# Altium project ESC_V2_Design.PrjPcb
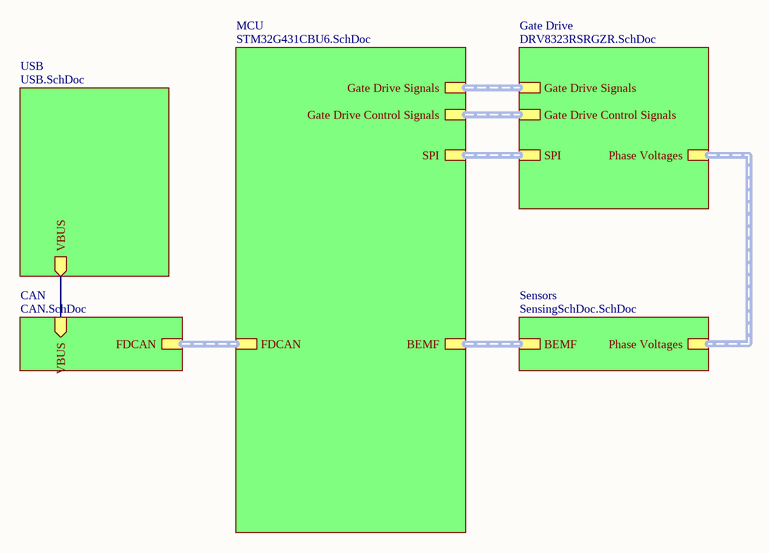
[diagram p0: Top Level.SchDoc]
6 sheets, 96 parts. Net scope: hierarchical (ports join the sheet entries above them; power ports are global).
Board file: PCB1.PcbDoc
Sheets:
  Top Level.SchDoc
    MCU = STM32G431CBU6.SchDoc
    Gate Drive = DRV8323RSRGZR.SchDoc
    Sensors = SensingSchDoc.SchDoc
    CAN = CAN.SchDoc
    USB = USB.SchDoc

## Sheet Top Level.SchDoc
size A4; SheetNumber: 1; SheetTotal: 6

### Sub-sheets
CAN = CAN.SchDoc: FDCAN, VBUS (in)
Gate Drive = DRV8323RSRGZR.SchDoc: Gate Drive Signals, SPI, Gate Drive Control Signals, Phase Voltages
MCU = STM32G431CBU6.SchDoc: Gate Drive Signals, SPI, Gate Drive Control Signals, BEMF, FDCAN
Sensors = SensingSchDoc.SchDoc: BEMF, Phase Voltages
USB = USB.SchDoc: VBUS (out)

### Nets
VBUS: sheet CAN/VBUS, sheet USB/VBUS

### Buses and harness runs
harness sheet CAN/FDCAN = sheet MCU/FDCAN
harness sheet Gate Drive/Gate Drive Control Signals = sheet MCU/Gate Drive Control Signals
harness sheet Gate Drive/Gate Drive Signals = sheet MCU/Gate Drive Signals
harness sheet Gate Drive/Phase Voltages = sheet Sensors/Phase Voltages
harness sheet Gate Drive/SPI = sheet MCU/SPI
harness sheet MCU/BEMF = sheet Sensors/BEMF

## Sheet STM32G431CBU6.SchDoc
size A3; SheetNumber: 2; SheetTotal: 6
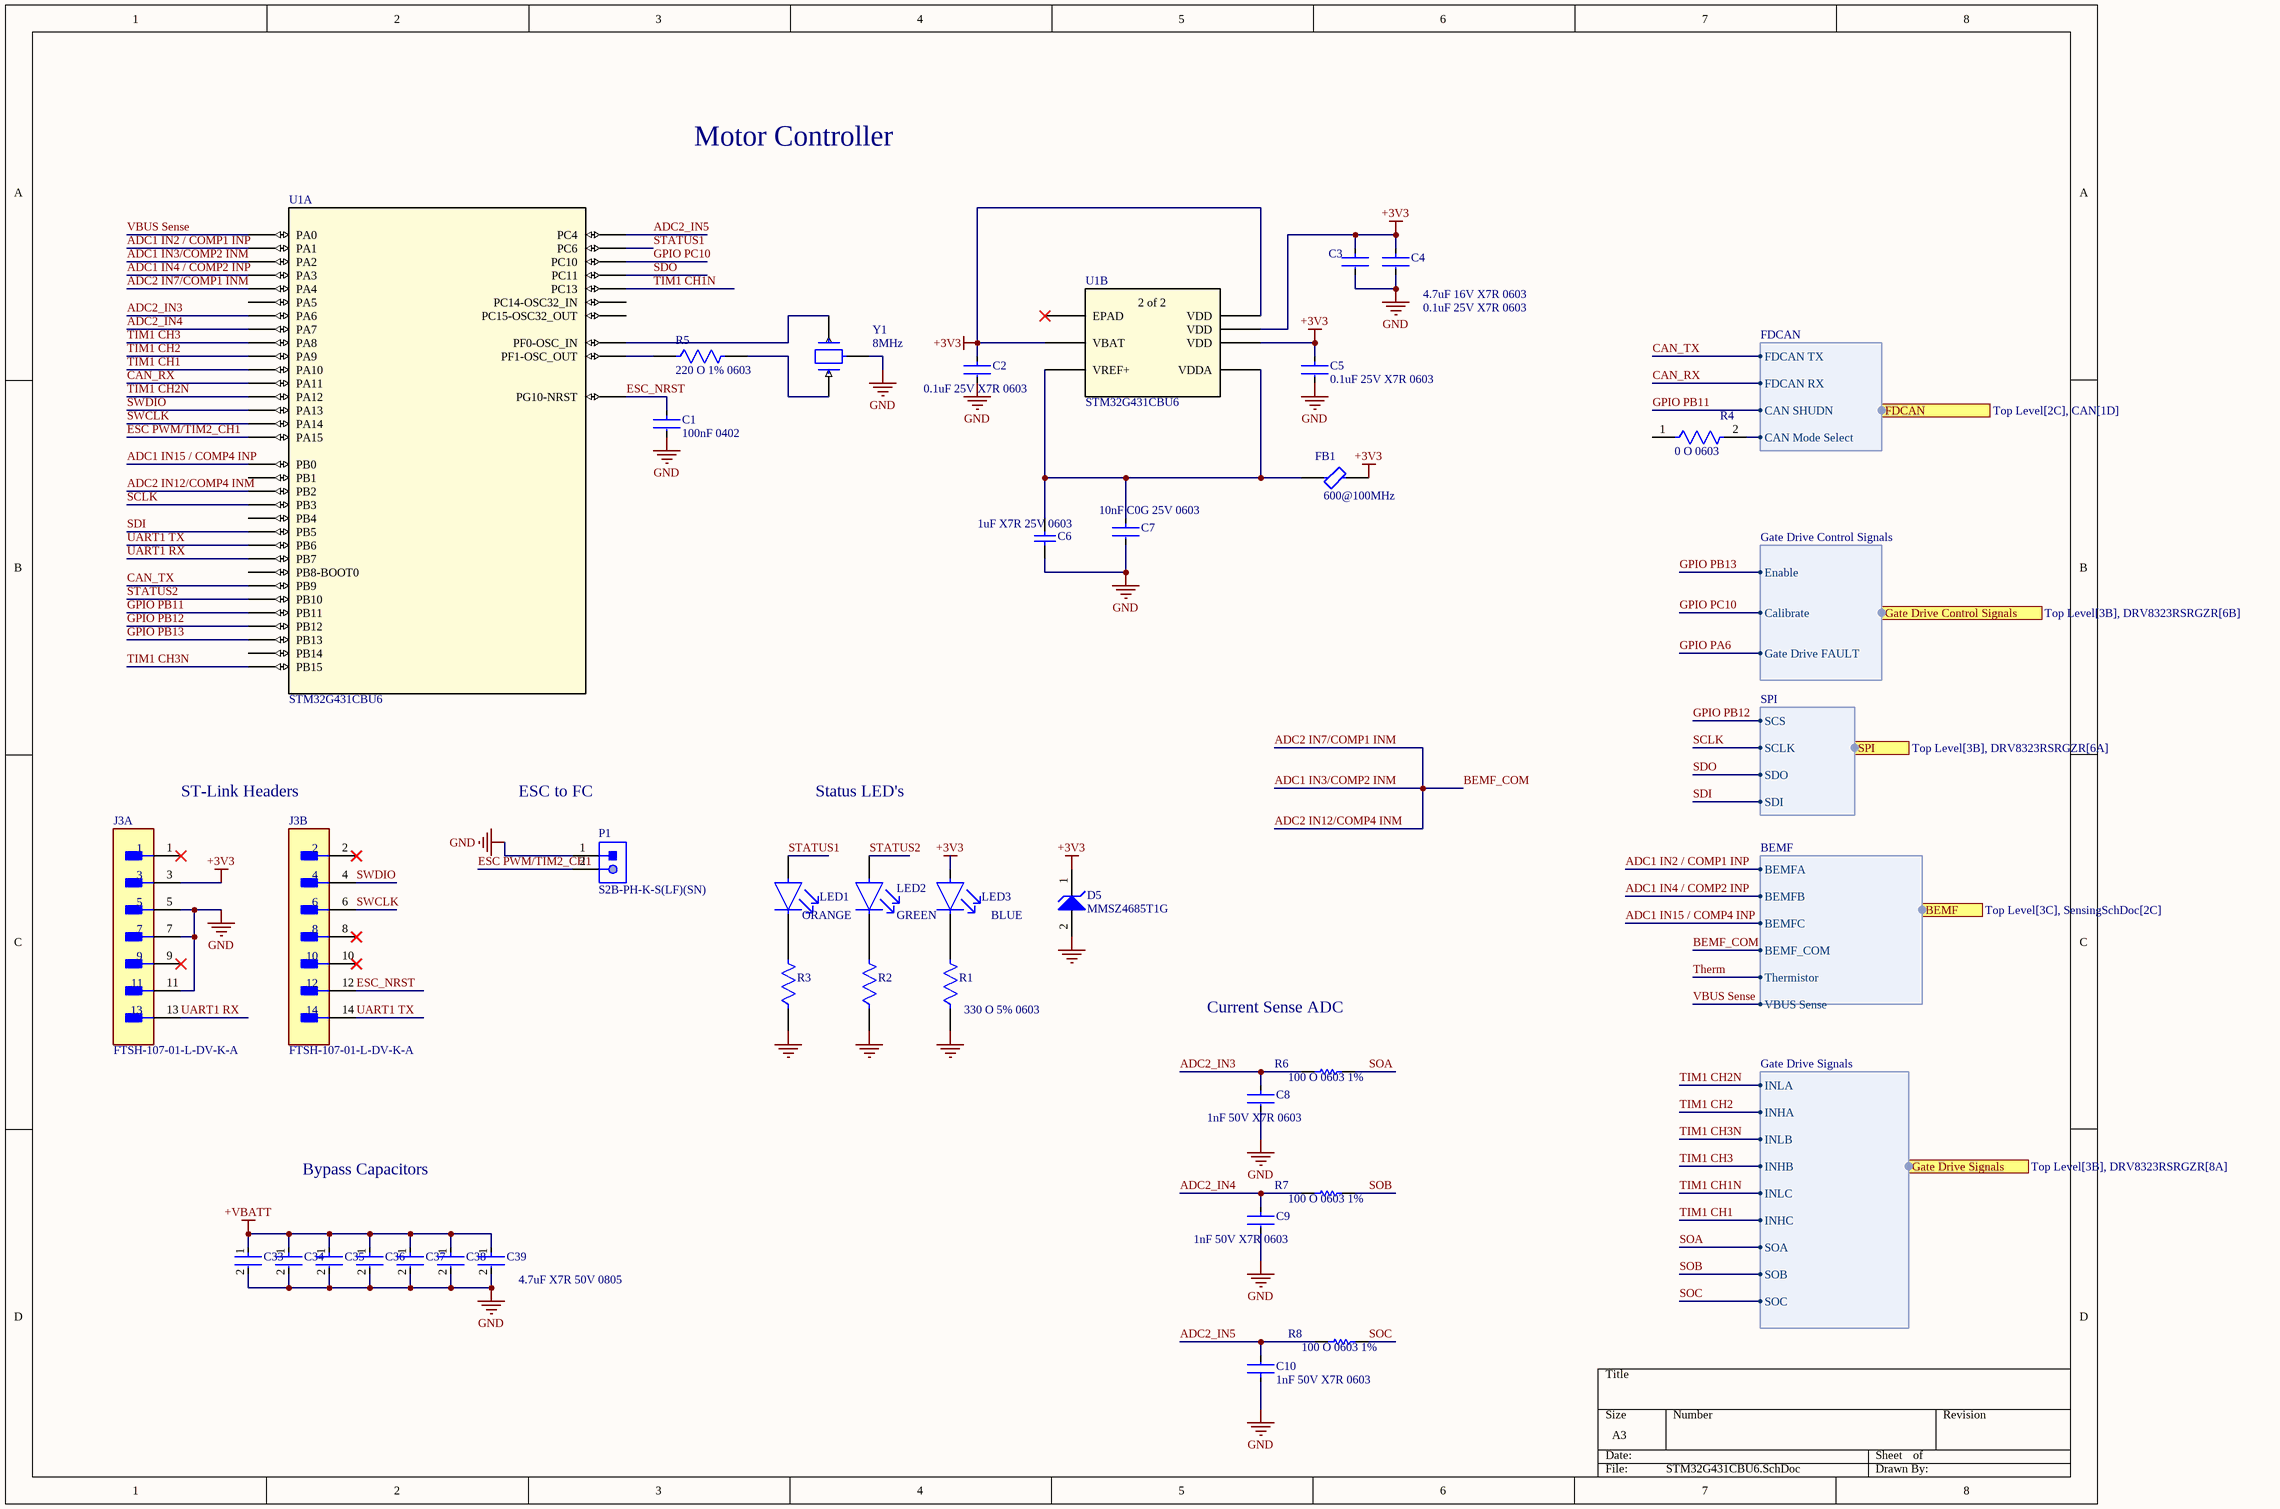
[diagram p1: STM32G431CBU6.SchDoc]

### Parts
C1  100nF 0402  [FP-GRM155-0_05-MFG]
C2  0.1uF 25V X7R 0603  [FP-C0603C-CF-MFG]
C3  4.7uF 16V X7R 0603  [FP-GRM188-0_2-IPC_A]
C4  0.1uF 25V X7R 0603  [FP-C0603C-CF-MFG]
C5  0.1uF 25V X7R 0603  [FP-C0603C-CF-MFG]
C6  1uF X7R 25V 0603  [CAPC1608X95X35NL15T15]
C7  10nF C0G 25V 0603  [FP-C0603C-CF-MFG]
C8  1nF 50V X7R 0603  [FP-C0603C-CF-MFG]
C9  1nF 50V X7R 0603  [FP-C0603C-CF-MFG]
C10  1nF 50V X7R 0603  [FP-C0603C-CF-MFG]
C33  4.7uF X7R 50V 0805  [FP-GRM21B-0_2-e0_2_0_7-IPC_C]  (value not drawn)
C34  4.7uF X7R 50V 0805  [FP-GRM21B-0_2-e0_2_0_7-IPC_C]  (value not drawn)
C35  4.7uF X7R 50V 0805  [FP-GRM21B-0_2-e0_2_0_7-IPC_C]  (value not drawn)
C36  4.7uF X7R 50V 0805  [FP-GRM21B-0_2-e0_2_0_7-IPC_C]  (value not drawn)
C37  4.7uF X7R 50V 0805  [FP-GRM21B-0_2-e0_2_0_7-IPC_C]  (value not drawn)
C38  4.7uF X7R 50V 0805  [FP-GRM21B-0_2-e0_2_0_7-IPC_C]  (value not drawn)
C39  4.7uF X7R 50V 0805  [FP-GRM21B-0_2-e0_2_0_7-IPC_C]
D5  MMSZ4685T1G  [ONSC-SOD-123-2-425-04_V]
FB1  600@100MHz  [FP-MPZ1608-0_8-MFG]
J3  FTSH-107-01-L-DV-K-A  [FP-FTSH-107-01-L-DV-K-A-MFG]  (parts A,B of 2)
LED1  ORANGE  [FP-6_541-5092_01-4-MFG]
LED2  GREEN  [FP-LTST-C193KGKT-5A-MFG]
LED3  BLUE  [FP-APT1608QBC-D-MFG]
P1  S2B-PH-K-S(LF)(SN)  [JST-S2B-PH-K-S_V]
R1  330 O 5% 0603  [FP-AC0603-IPC_C]
R2  AC0603JR-07330RL  [FP-AC0603-IPC_C]  (value not drawn)
R3  AC0603JR-07330RL  [FP-AC0603-IPC_C]  (value not drawn)
R4  0 O 0603  [FP-MCT0603-IPC_C]
R5  220 O 1% 0603  [FP-AC0603-IPC_A]
R6  100 O 0603 1%  [RESC1608X55X25ML10T15]
R7  100 O 0603 1%  [RESC1608X55X25ML10T15]
R8  100 O 0603 1%  [RESC1608X55X25ML10T15]
U1  STM32G431CBU6  [UFQFPN-48_7X7X0P55MM]  (parts A,B of 2)
Y1  8MHz  [FP-CSTNE8M00GH5C000R0-MFG]

### Ports
BEMF (harness BEMF, see Top Level[3C], SensingSchDoc[2C]), FDCAN (harness FDCAN, see Top Level[2C], CAN[1D]), Gate Drive Control Signals (harness Gate Drive Control Signals, see Top Level[3B], DRV8323RSRGZR[6B]), Gate Drive Signals (harness Gate Drive Signals, see Top Level[3B], DRV8323RSRGZR[8A]), SPI (harness SPI, see Top Level[3B], DRV8323RSRGZR[6A])

### Harnesses
SPI: SCLK, SDO, SDI, SCS
Gate Drive Signals: INLA, INHA, INLB, INHB, INLC, INHC, SOA, SOB, SOC
Gate Drive Control Signals: Enable, Calibrate, Gate Drive FAULT
BEMF: BEMFA, BEMFB, BEMFC, VBUS Sense, Thermistor, BEMF_COM
FDCAN: FDCAN TX, FDCAN RX, CAN SHUDN, CAN Mode Select

### Nets
+3V3: C2.1 C3.1 C4.1 C5.1 D5.1(K) FB1.2 J3.3 LED3.2(A) U1.1(VBAT) U1.23(VDD) U1.35(VDD) U1.48(VDD)
+VBATT: C33.1 C34.1 C35.1 C36.1 C37.1 C38.1 C39.1
GND: C1.2 C2.2 C3.2 C4.2 C5.2 C6.1 C7.2 C8.2 C9.2 C10.1 C33.2 C34.2 C35.2 C36.2 C37.2 C38.2 C39.2 D5.2(A) J3.5 J3.7 J3.11 P1.1 R1.1 R2.1 R3.1 Y1.2(GND)  [project net SNA]
ADC1 IN2 / COMP1 INP: U1.9(PA1) ; port BEMF.BEMFA
ADC1 IN3/COMP2 INM: U1.10(PA2) U1.12(PA4) U1.19(PB2) ; port BEMF.BEMF_COM  [also labelled ADC2 IN12/COMP4 INM, ADC2 IN7/COMP1 INM, BEMF_COM]
ADC1 IN4 / COMP2 INP: U1.11(PA3) ; port BEMF.BEMFB
ADC1 IN15 / COMP4 INP: U1.17(PB0) ; port BEMF.BEMFC
ADC2_IN3: C8.1 R6.1 U1.14(PA6)
ADC2_IN4: C9.1 R7.1 U1.15(PA7)
ADC2_IN5: C10.2 R8.1 U1.16(PC4)
CAN Mode: R4.2 ; port FDCAN.CAN Mode Select
CAN_RX: U1.33(PA11) ; port FDCAN.FDCAN RX
CAN_TX: U1.47(PB9) ; port FDCAN.FDCAN TX
ESC PWM/TIM2_CH1: P1.2 U1.38(PA15)
ESC_NRST: C1.1 J3.12 U1.7(PG10-NRST)
GPIO PB11: U1.24(PB11) ; port FDCAN.CAN SHUDN
GPIO PB12: U1.25(PB12) ; port SPI.SCS
GPIO PB13: U1.26(PB13) ; port Gate Drive Control Signals.Enable
GPIO PC10: U1.39(PC10) ; port Gate Drive Control Signals.Calibrate
SCLK: U1.41(PB3) ; port SPI.SCLK
SDI: U1.43(PB5) ; port SPI.SDI
SDO: U1.40(PC11) ; port SPI.SDO
SOA: R6.2 ; port Gate Drive Signals.SOA
SOB: R7.2 ; port Gate Drive Signals.SOB
SOC: R8.2 ; port Gate Drive Signals.SOC
STATUS1: LED1.2(A) U1.29(PC6)
STATUS2: LED2.2(A) U1.22(PB10)
SWCLK: J3.6 U1.37(PA14)
SWDIO: J3.4 U1.36(PA13)
TIM1 CH1: U1.32(PA10) ; port Gate Drive Signals.INHC
TIM1 CH1N: U1.2(PC13) ; port Gate Drive Signals.INLC
TIM1 CH2: U1.31(PA9) ; port Gate Drive Signals.INHA
TIM1 CH2N: U1.34(PA12) ; port Gate Drive Signals.INLA
TIM1 CH3: U1.30(PA8) ; port Gate Drive Signals.INHB
TIM1 CH3N: U1.28(PB15) ; port Gate Drive Signals.INLB
UART1 RX: J3.13 U1.45(PB7)
UART1 TX: J3.14 U1.44(PB6)
VBUS Sense: U1.8(PA0) ; port BEMF.VBUS Sense
NetC6_2: C6.2 C7.1 FB1.1 U1.20(VREF+) U1.21(VDDA)
NetLED1_1: LED1.1(C) R3.2
NetLED2_1: LED2.1(C) R2.2
NetLED3_1: LED3.1(C) R1.2
NetR5_1: R5.1 U1.6(PF1-OSC_OUT)
NetR5_2: R5.2 Y1.1(Input)
NetU1_5: U1.5(PF0-OSC_IN) Y1.3(Output)

Not connected (* = marked no-connect by the designer): J3 1* 2* 8* 9* 10*; R4 1; U1 3(PC14-OSC32_IN) 4(PC15-OSC32_OUT) 13(PA5) 18(PB1) 27(PB14) 42(PB4) 46(PB8-BOOT0) 49(EPAD)*

### Notes on the sheet
- Motor Controller
- ST-Link Headers
- ESC to FC
- Status LED's
- Current Sense ADC
- Bypass Capacitors
- (in symbol STM32G431CBU6, part B) 2 of 2

### Library data of the parts
C1 = CMP-06035-025734-1: Chip Multilayer Ceramic Capacitors for General Purpose, 0402, 0.10uF, X7R, 15%, 20%, 25V
C2 C4 C5 = CMP-2006-03731-2: CAP CER 0.1UF 25V X7R 0603; Manufacturer Part Number: C0603C104K3RACAUTO; Manufacturer: KEMET; Capacitance: 0.10 μF; Automotive Grade: Grade 1; Tolerance: 0.1; Material: Ceramic; Temperature Coefficient: 30ppm/°C; Value: 0.10 μF; Digikey Description: CAP CER 0.1UF 25V X7R 0603; RoHS: TRUE; ComponentLink2Description: Datasheet; Temperature Range High: +125°C; Temperature Characteristic: X7R; Automotive: Yes; Package: C0603C-CF; ComponentLink2URL: https://api.kemet.com/component-edge/download/datasheet/C0603C100J5GACAUTO.pdf; Lead Free: Yes; Device Class L2: Capacitors; Device Class L3: Ceramic Capacitors; Device Class L1: Passive Components; Octopart: https://octopart.com/c0603c104k3racauto-kemet-12595587; Height: 0.87mm; Mouser Description: Multilayer Ceramic Capacitors MLCC - SMD/SMT 0.1uF 25volts 10% X7R AUTO; Category: Cap; Voltage Rating: 25 V; Temperature Range Low: -55°C; Temperature: -55°C to +125°C
C3 = CMP-06035-045467-1: Chip Multilayer Ceramic Capacitors for General Purpose, 0603, 4.7uF, X7R, 15%, 10%, 16V
C6 = CMP-2006-02217-1: Part Number: C0603C105M3RACTU; Manufacturer: Kemet
C7 = CMP-03020-015349-1: C0603 10,000 pF C0G 30ppm/°C 5.00% 25 V; Manufacturer: KEMET; Manufacturer Part Number: C0603C103J3GACAUTO; Automotive Grade: Grade 1; Material: Ceramic; Tolerance: 0.05; Mouser Description: Cap Ceramic 0.01uF 25V C0G 5% Pad SMD 0603 125C Automotive T/R; Temperature Characteristic: C0G; Device Class L3: Ceramic Capacitors; Device Class L1: Passive Components; Capacitance: 10,000 pF; Temperature Range High: +125°C; Voltage Rating: 25 V; RoHS: TRUE; Temperature: -55°C to +125°C; Device Class L2: Capacitors; Temperature Range Low: -55°C; Package: C0603C-CF; Value: 10,000 pF; ComponentLink2Description: Datasheet; Height: 0.87mm; Octopart: https://octopart.com/c0603c103j3gacauto-kemet-75532652; Lead Free: Yes; Automotive: Yes; ComponentLink2URL: https://api.kemet.com/component-edge/download/datasheet/C0603C100J5GACAUTO.pdf; Category: Cap; Temperature Coefficient: 30ppm/°C
C8-C10 = CMP-2006-03716-2: CAP CER 1000PF 50V X7R 0603; Manufacturer Part Number: C0603C102K5RACAUTO; Manufacturer: KEMET; Material: Ceramic; Automotive Grade: Grade 1; Value: 1,000 pF; Tolerance: 0.1; Temperature Coefficient: 30ppm/°C; Category: Cap; Automotive: Yes; Temperature Range High: +125°C; Temperature Range Low: -55°C; Temperature Characteristic: X7R; Device Class L1: Passive Components; Height: 0.87mm; Lead Free: Yes; Capacitance: 1,000 pF; Package: C0603C-CF; Digikey Description: CAP CER 1000PF 50V X7R 0603; Voltage Rating: 50 V; ComponentLink2URL: https://api.kemet.com/component-edge/download/datasheet/C0603C100J5GACAUTO.pdf; Mouser Description: Multilayer Ceramic Capacitors MLCC - SMD/SMT 1000pF 50volts 10% X7R AUTO; RoHS: TRUE; Octopart: https://octopart.com/c0603c102k5racauto-kemet-18822673; Device Class L3: Ceramic Capacitors; ComponentLink2Description: Datasheet; Device Class L2: Capacitors; Temperature: -55°C to +125°C
C33-C39 = CMP-06035-056600-1: Chip Multilayer Ceramic Capacitors for General Purpose, 0805, 4.7uF, X7R, 15%, 10%, 50V
D5 = CMP-1060-00574-1: Zener Voltage Regulator, 500 mW, 2-Pin SOD-123, Pb-Free, Tape and Reel; Manufacturer: On Semiconductor; VZ Typ (V): 3.6; P Max (W): 0.5; DatasheetVersion: Rev. 9; ComponentLink2Description: Datasheet; Mounting Technology: Surface Mount; ComponentLink3URL: http://www.onsemi.com/pub_link/Collateral/425-04.PDF; ComponentLink3Description: Package Specification; RoHS: Pb-Free; PartNumber: MMSZ4685T1G; ComponentLink1URL: http://www.onsemi.com/; PackageDescription: 2-Pin SOD, Body 1.6 x 2.69 mm; ComponentLink2URL: http://www.onsemi.com/pub_link/Collateral/MMSZ4678T1-D.PDF; ComponentLink1Description: Manufacturer URL; Packing: Tape and Reel; PackageVersion: Rev. G, 10/2009; PackageReference: SOD-123-2-425-04
FB1 = CMP-08257-000179-1: Power line Ferrite Bead 600Ω @ 100MHz 1A DCR 0.15Ω SMD 0603; Impedance: 600R; DC Resistance (DCR): 150mR; Tolerance: 25%; Depth: 0.8mm; Packaging: Tape and Reel; Package Quantity: 4000; Height: 0.8mm; Length: 0.063inch; Series: MPZ; Weight: 7.1E-05oz; Width: 0.8mm; Mount: Surface Mount; Case Code (Imperial): 0603; Case/Package: 0603; Max Operating Temperature: 125°C; Max DC Current: 1A; Test Frequency: 100MHz; Min Operating Temperature: -55°C; Current Rating: 1A; Core Material: Ferrite; RoHS Compliant: Yes; REACH SVHC: No SVHC; Case Code (Metric): 1608; Termination: SMD/SMT; Lead Free: Lead Free
J3 = CMP-02766-001414-1: CONN HEADER SMD 14POS 1.27MM; Number of Contacts: 14; Gender: Male; Contact Plating: Gold; Termination: Solder; Lead Free: Lead Free; Contact Material: Bronze; Pitch: 1.27mm; Number of Rows: 2; RoHS Compliant: Yes
LED1 = CMP-00030-21709200-1: VLMO1300-GS08 LED Uni-Color Soft Orange 611nm 2-Pin Chip 0603(1608Metric) T/R; Test Current: 20mA; Dominant Wavelength: 605nm; Lens Style: Clear, Rectangular; Reverse Voltage: 5V; Power Dissipation: 75mW; Luminous Intensity: 90mcd; Viewing Angle: 130°; Number of LEDs: 1; Forward Voltage: 2V; Illumination Color: Orange; Ambient Temperature Range High: 85°C; Radiation Hardening: No; Case Code (Metric): 1608; Case Code (Imperial): 0603; Forward Current: 20mA; Number of Pins: 2; Packaging: Cut Tape; Case/Package: 0603; Depth: 800µm; RoHS: Compliant; Schedule B: 8541402000, 8541402000; Length: 1.6mm; Power Rating: 75mW; Mount: Surface Mount; NexarPartId: 21709200; Min Operating Temperature: -35°C; Width: 800µm; REACH SVHC: Unknown; Lead Free: Lead Free; Color: Orange; Wavelength: 605nm; Max Operating Temperature: 85°C; Height: 800µm; Number of Elements: 1
LED2 = CMP-2000-06622-2: LED GREEN CLEAR CHIP SMD; Forward Current: 30mA; Power Dissipation: 75mW; Luminous Intensity: 28mcd; Lens Style: Diffused; Lens Color: Colorless; Forward Voltage: 2.3V; Test Current: 5mA; Viewing Angle: 130°; Reverse Voltage: 5V; Dominant Wavelength: 576.5nm; Number of Elements: 1; Number of Pins: 2; Case/Package: 0603; Width: 0.8mm; Radiation Hardening: No; Lead Free: Lead Free; Lens Transparency: Clear; Max Operating Temperature: 85°C; Illumination Color: Green; Color: Green; Packaging: Tape and Reel; Depth: 0.8mm; Length: 1.6mm; Mount: Surface Mount; Case Code (Imperial): 0603; Height: 0.35mm; Min Operating Temperature: -55°C; Package Quantity: 3000; Case Code (Metric): 1608; Power Rating: 75mW; Number of LEDs: 1
LED3 = CMP-2000-05788-2: LED BLUE CLEAR CHIP SMD; Lens Style: Flat; Forward Current: 20mA; Luminous Intensity: 100mcd; Number of LEDs: 1; Dominant Wavelength: 465nm; Lens Color: Colorless; Forward Voltage: 3.3V; Viewing Angle: 120°; Case Code (Imperial): 0603; Number of Pins: 2; Length: 1.6mm; Mount: Surface Mount; Color: Blue; Width: 0.8mm; Height: 0.75mm; Case/Package: 0603; Lead Free: Lead Free; Case Code (Metric): 1608; Lens Transparency: Clear; Min Operating Temperature: -40°C; Packaging: Tape and Reel; Max Operating Temperature: 85°C; Package Quantity: 2000; Test Current: 20mA; Illumination Color: Blue
P1 = CMP-1755-00004-1: Male Header, Pitch 2 mm, 1 x 2 Position, Height 4.8 mm, Tail Length 3.4 mm, -25 to 85 degC, RoHS, Bulk; Case\Package: Radial; Tolerance: 20%; Capacitance: 10 uF; Voltage Rating (DC): 50 V; Packaging: Bulk; ComponentLink1URL: http://www.jst-mfg.com/product/pdf/eng/ePH.pdf; Radiation Hardening: No; Height: 11 mm; Package Quantity: 200; PackageDescription: Male Header, Pitch 2 mm, 1 x 2 Position, Height 4.8 mm, Tail Length 3.4 mm; PackageReference: S2B-PH-K-S; Diameter: 5 mm; Pins: 2; Mount: Through Hole; Max Operating Temperature: 85 degC; Min Operating Temperature: -40 degC; ComponentLink1Description: Datasheet; DatasheetVersion: Dec-12; Length: 11 mm; Lead Pitch: 2 mm; REACH SVHC: No SVHC; Voltage Rating: 50 V; RoHSCompliant: true
R1 = CMP-03412-039929-1: RES 330Ω 5.00% 0.1W 0603; Voltage Rating: 50V; Power Rating: 100mW; Temperature Coefficient: 100ppm/°C; Resistance: 330R; Series: AC; Case/Package: 0603; Weight: 7.1E-05oz; Min Operating Temperature: -55°C; Ratings: AEC-Q200; Width: 0.8mm; Resistor Type: Thick Film; Termination: SMD/SMT; Tolerance: 5%; Number of Terminations: 2; Max Power Dissipation: 100mW; Case Code (Imperial): 0603; Case Code (Metric): 1608; Height: 0.45mm; Max Operating Temperature: 155°C; Length: 1.6mm; RoHS Compliant: Yes; Features: Moisture Resistant; Packaging: Tape and Reel
R2 R3 = CMP-03412-039929-1: RES 330Ω 5.00% 0.1W 0603; Voltage Rating: 50V; Power Rating: 100mW; Tolerance: 5%; Temperature Coefficient: 100ppm/°C; Resistance: 330R; Series: AC; Case/Package: 0603; Weight: 7.1E-05oz; Min Operating Temperature: -55°C; Ratings: AEC-Q200; Width: 0.8mm; Resistor Type: Thick Film; Termination: SMD/SMT; Number of Terminations: 2; Max Power Dissipation: 100mW; Case Code (Imperial): 0603; Case Code (Metric): 1608; Height: 0.45mm; Max Operating Temperature: 155°C; Length: 1.6mm; RoHS Compliant: Yes; Features: Moisture Resistant; Packaging: Tape and Reel
R4 = CMP-02407-001385-1: RES SMD 100 OHM 1% 1/8W 0603; Voltage Rating (DC): 75V; Resistance: 0mR; Max Power Dissipation: 125mW; Power Rating: 100mW; Case Code (Imperial): 0603; Packaging: Tape and Reel; Length: 1.55mm; Case Code (Metric): 1608; Military Standard: Not; Lead Free: Lead Free; Width: 0.033inch; Voltage Rating: 75V; Case/Package: 0603; Composition: Thin Film; Radiation Hardening: No; Depth: 0.85mm; Max Operating Temperature: 125°C; Number of Terminations: 2; Height: 0.022inch; REACH SVHC: No SVHC; Mount: Surface Mount; Package Quantity: 1; Contact Plating: Tin; Min Operating Temperature: -55°C
R5 = CMP-03412-024663-2: RES 220Ω 1.00% 0.1W 0603; Max Power Dissipation: 100mW; Voltage Rating: 50V; Temperature Coefficient: 100ppm/°C; Resistance: 220R; Max Operating Temperature: 155°C; Case/Package: 0603; Case Code (Imperial): 0603; RoHS Compliant: Yes; Height: 0.45mm; Case Code (Metric): 1608; Resistor Type: Thick Film; Width: 0.8mm; Series: AC; Number of Terminations: 2; Features: Moisture Resistant; Tolerance: 1%; Ratings: AEC-Q200; Min Operating Temperature: -55°C; Power Rating: 100mW; Packaging: Tape and Reel; Termination: SMD/SMT; Length: 1.6mm
R6-R8 = CMP-2000-04173-1: Part Number: RC0603FR-10100RL; Manufacturer: Yageo
U1 = STM32G431CBU6: Mainstream Arm Cortex-M4 MCU 170 MHz with 128 Kbytes of Flash memory, Math Accelerator, Medium Analog level integration; Manufacturer_Name: STMicroelectronics; Copyright: Copyright (C) 2025 Ultra Librarian. All rights reserved.; Manufacturer_Part_Number: STM32G431CBU6; Datasheet: https://www.st.com/resource/en/datasheet/stm32g431c6.pdf; RefDes: RefDes; Type: Type
Y1 = CMP-06057-000001-1: CERAMIC RES 8.0000MHZ 33PF SMD; Frequency Stability: 0.13%; Frequency Tolerance: 0.07%; Impedance: 40R; Mount: Surface Mount; Min Operating Temperature: -40°C; Max Operating Temperature: 125°C; Resistor Type: Ceramic; Capacitance: 33pF; Packaging: Tape and Reel; Frequency: 8MHz; Case/Package: SMD/SMT

## Sheet DRV8323RSRGZR.SchDoc
size A3; SheetNumber: 3; SheetTotal: 6
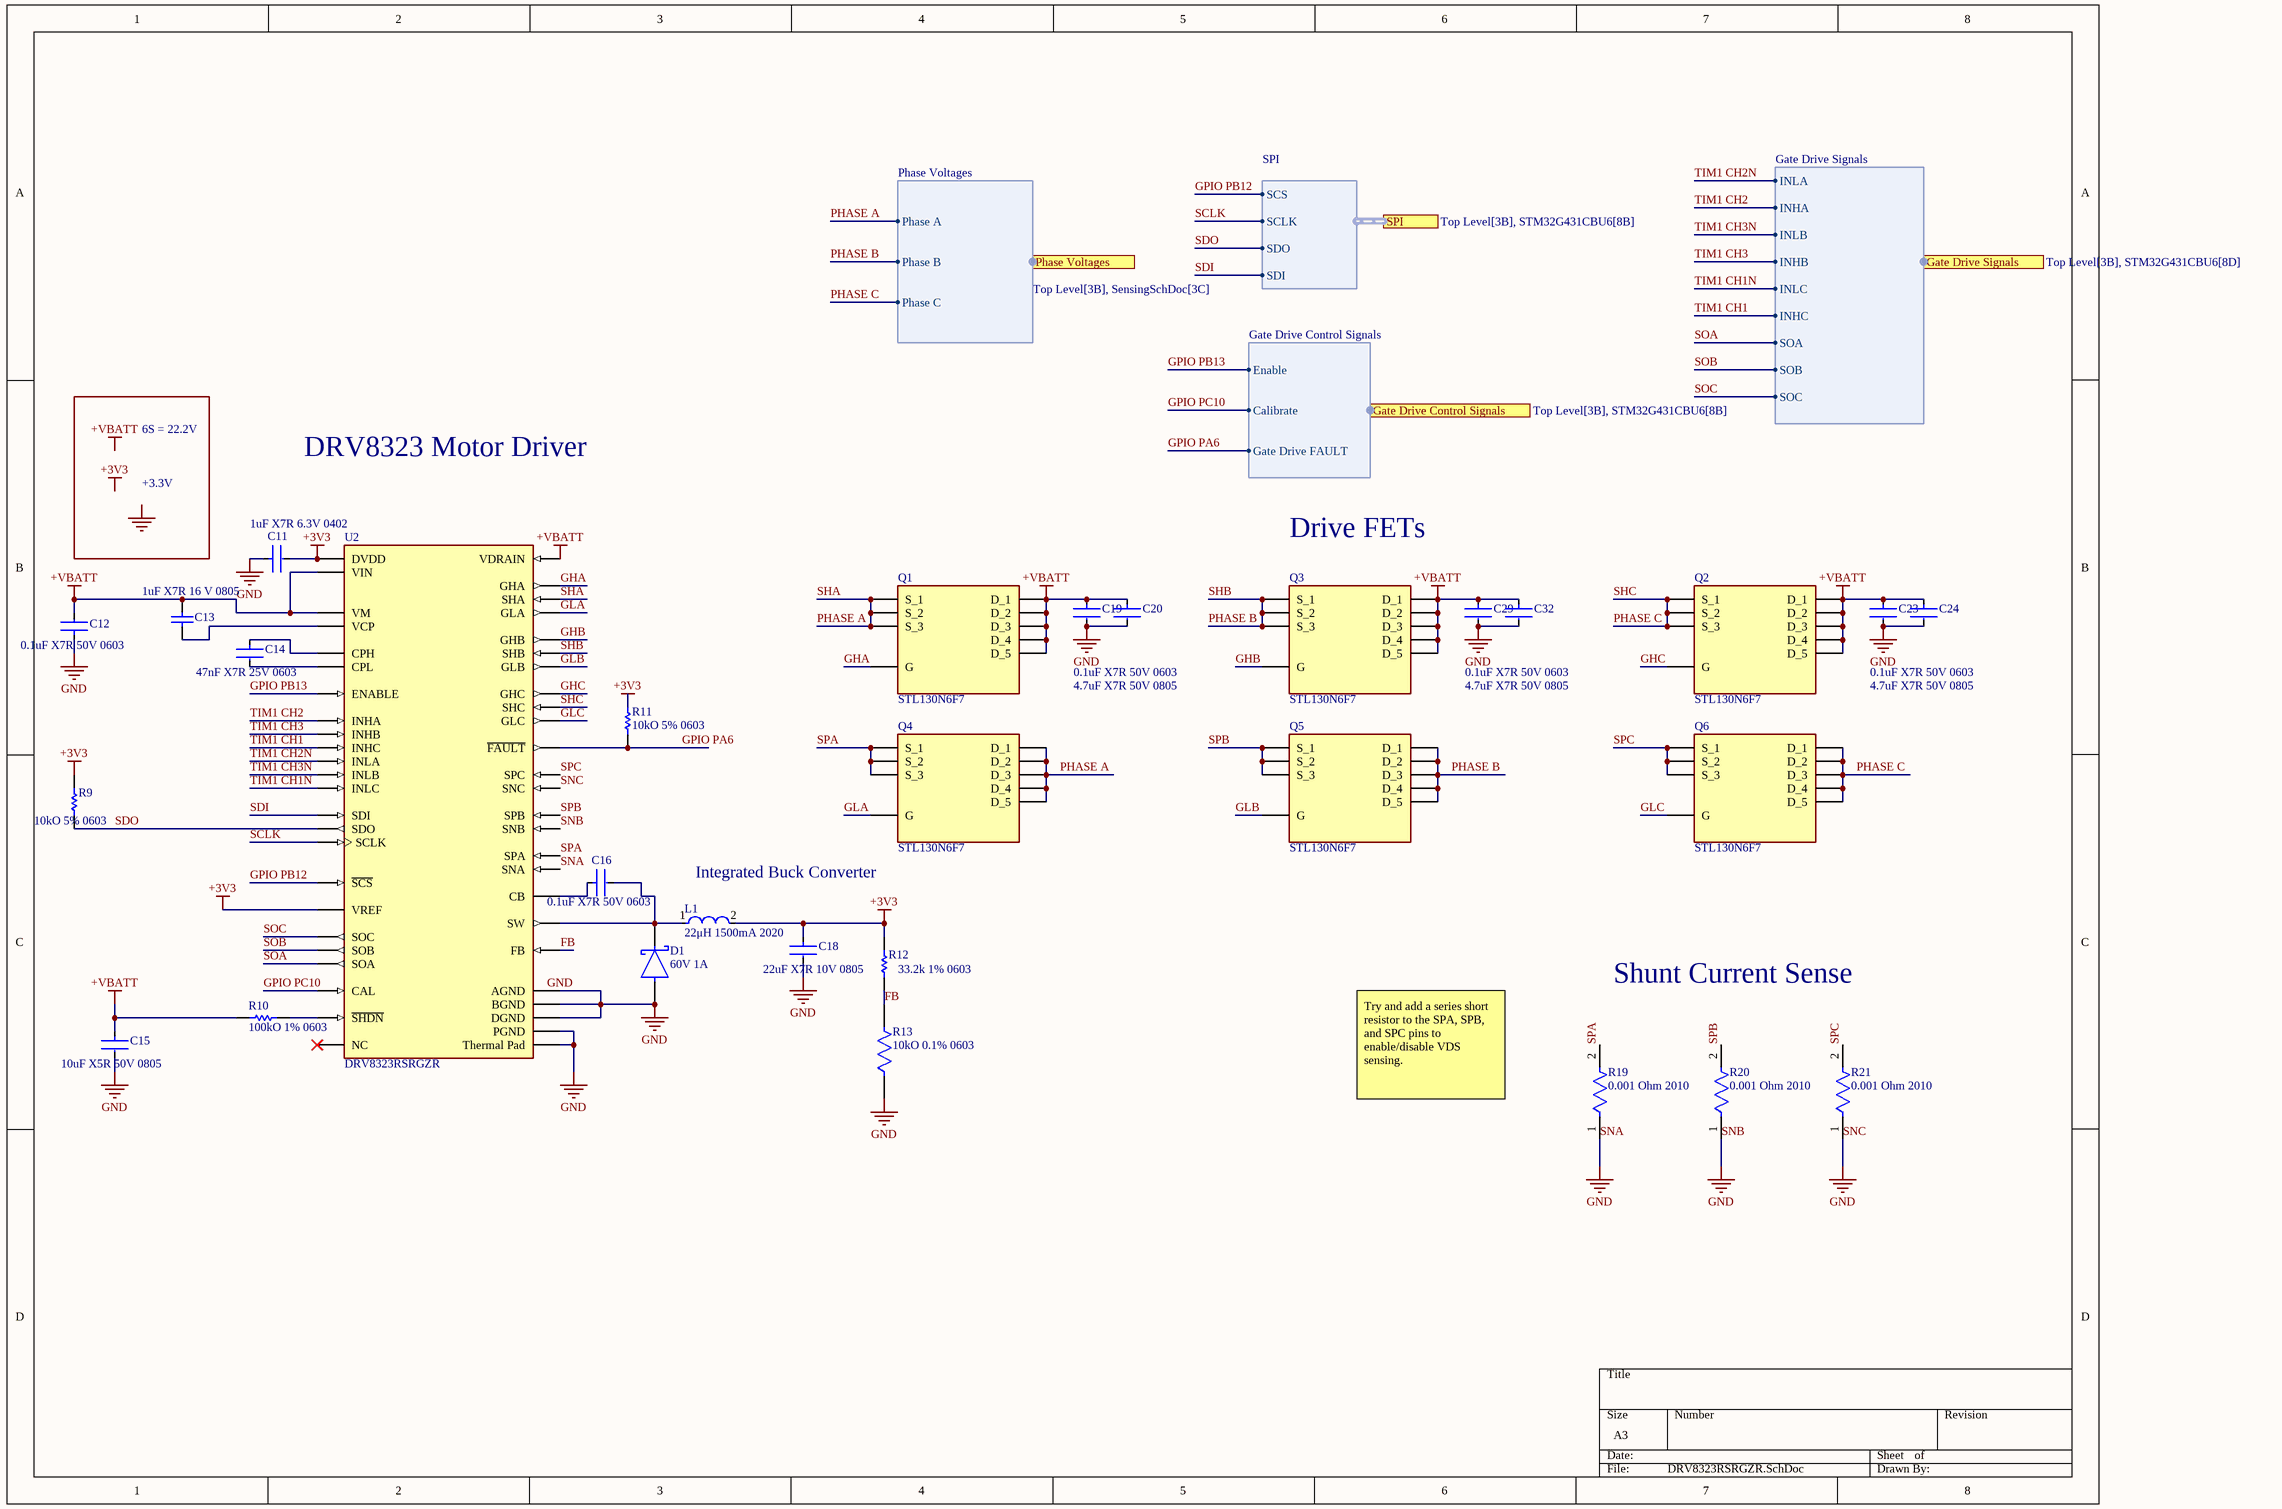
[diagram p2: DRV8323RSRGZR.SchDoc]

### Parts
C11  1uF X7R 6.3V 0402  [FP-GRT155-0_05-IPC_C]
C12  0.1uF X7R 50V 0603  [FP-0603B104K500CT-IPC_C]
C13  1uF X7R 16 V 0805  [CAPC2013X140X50NL20T25]
C14  47nF X7R 25V 0603  [FP-C0603C-CF-MFG]
C15  10uF X5R 50V 0805  [FP-GRM21B-0_2-e0_2_0_7-IPC_A]
C16  0.1uF X7R 50V 0603  [FP-0603B104K500CT-IPC_C]
C18  22uF X7R 10V 0805  [FP-GRM21B-0_2-e0_2_0_7-MFG]
C19  0.1uF X7R 50V 0603  [FP-0603B104K500CT-IPC_C]
C20  4.7uF X7R 50V 0805  [FP-GRM21B-0_2-e0_2_0_7-MFG]
C23  0.1uF X7R 50V 0603  [FP-0603B104K500CT-IPC_C]
C24  4.7uF X7R 50V 0805  [FP-GRM21B-0_2-e0_2_0_7-MFG]
C29  0.1uF X7R 50V 0603  [FP-0603B104K500CT-IPC_C]
C32  4.7uF X7R 50V 0805  [FP-GRM21B-0_2-e0_2_0_7-MFG]
D1  60V 1A  [FP-SMA-MFG]
L1  22μH 1500mA 2020  [FP-LQH5BPN_38-MFG]
Q1  STL130N6F7  [FERD20U50DJFTR]
Q2  STL130N6F7  [FERD20U50DJFTR]
Q3  STL130N6F7  [FERD20U50DJFTR]
Q4  STL130N6F7  [FERD20U50DJFTR]
Q5  STL130N6F7  [FERD20U50DJFTR]
Q6  STL130N6F7  [FERD20U50DJFTR]
R9  10kO 5% 0603  [RESC1608X55X25LL10T15]
R10  100kO 1% 0603  [RESC1608X55X25ML10T15]
R11  10kO 5% 0603  [RESC1608X55X25LL10T15]
R12  33.2k 1% 0603  [RESC1608X55X25NL10T15]
R13  10kO 0.1% 0603  [FP-RT0603-MFG]
R19  0.001 Ohm 2010  [FP-WSL2010-1_47-MFG]
R20  0.001 Ohm 2010  [FP-WSL2010-1_47-MFG]
R21  0.001 Ohm 2010  [FP-WSL2010-1_47-MFG]
U2  DRV8323RSRGZR  [FP-RGZ0048A-MFG]

### Ports
Gate Drive Control Signals (harness Gate Drive Control Signals, see Top Level[3B], STM32G431CBU6[8B]), Gate Drive Signals (harness Gate Drive Signals, see Top Level[3B], STM32G431CBU6[8D]), Phase Voltages (harness Phase Voltages, see Top Level[3B], SensingSchDoc[3C]), SPI (harness SPI, see Top Level[3B], STM32G431CBU6[8B])

### Harnesses
SPI: SCLK, SDO, SDI, SCS
Phase Voltages: Phase A, Phase B, Phase C
Gate Drive Control Signals: Enable, Calibrate, Gate Drive FAULT
Gate Drive Signals: INLA, INHA, INLB, INHB, INLC, INHC, SOA, SOB, SOC

### Nets
+3V3: C11.2 C18.1 L1.2 R9.2 R11.2 R12.2 U2.26(VREF) U2.36(DVDD)
+VBATT: C12.2 C13.1 C15.1 C19.1 C20.1 C23.1 C24.1 C29.1 C32.1 Q1.5(D_1) Q1.6(D_2) Q1.7(D_3) Q1.8(D_4) Q1.9(D_5) Q2.5(D_1) Q2.6(D_2) Q2.7(D_3) Q2.8(D_4) Q2.9(D_5) Q3.5(D_1) Q3.6(D_2) Q3.7(D_3) Q3.8(D_4) Q3.9(D_5) R10.2 U2.6(VM) U2.7(VDRAIN) U2.47(VIN)
SNA: C11.1 C12.1 C15.2 C18.2 C19.2 C20.2 C23.2 C24.2 C29.2 C32.2 D1.2(A) R13.1 R19.1 R20.1 R21.1 U2.2(PGND) U2.12(SNA) U2.13(SNB) U2.22(SNC) U2.27(DGND) U2.35(AGND) U2.43(BGND) U2.49(Thermal_Pad)  [also labelled GND, SNB, SNC]
FB: R12.1 R13.2 U2.1(FB)
GHA: Q1.4(G) U2.8(GHA)
GHB: Q3.4(G) U2.17(GHB)
GHC: Q2.4(G) U2.18(GHC)
GLA: Q4.4(G) U2.10(GLA)
GLB: Q5.4(G) U2.15(GLB)
GLC: Q6.4(G) U2.20(GLC)
GPIO PA6: R11.1 U2.28(~{FAULT}) ; port Gate Drive Control Signals.Gate Drive FAULT
GPIO PB12: U2.32(~{SCS}) ; port SPI.SCS
GPIO PB13: U2.33(ENABLE) ; port Gate Drive Control Signals.Enable
GPIO PC10: U2.34(CAL) ; port Gate Drive Control Signals.Calibrate
PHASE A: Q1.1(S_1) Q1.2(S_2) Q1.3(S_3) Q4.5(D_1) Q4.6(D_2) Q4.7(D_3) Q4.8(D_4) Q4.9(D_5) U2.9(SHA) ; port Phase Voltages.Phase A  [also labelled SHA]
PHASE B: Q3.1(S_1) Q3.2(S_2) Q3.3(S_3) Q5.5(D_1) Q5.6(D_2) Q5.7(D_3) Q5.8(D_4) Q5.9(D_5) U2.16(SHB) ; port Phase Voltages.Phase B  [also labelled SHB]
PHASE C: Q2.1(S_1) Q2.2(S_2) Q2.3(S_3) Q6.5(D_1) Q6.6(D_2) Q6.7(D_3) Q6.8(D_4) Q6.9(D_5) U2.19(SHC) ; port Phase Voltages.Phase C  [also labelled SHC]
SCLK: U2.31(SCLK) ; port SPI.SCLK
SDI: U2.30(SDI) ; port SPI.SDI
SDO: R9.1 U2.29(SDO) ; port SPI.SDO
SOA: U2.25(SOA) ; port Gate Drive Signals.SOA
SOB: U2.24(SOB) ; port Gate Drive Signals.SOB
SOC: U2.23(SOC) ; port Gate Drive Signals.SOC
SPA: Q4.1(S_1) Q4.2(S_2) Q4.3(S_3) R19.2 U2.11(SPA)
SPB: Q5.1(S_1) Q5.2(S_2) Q5.3(S_3) R20.2 U2.14(SPB)
SPC: Q6.1(S_1) Q6.2(S_2) Q6.3(S_3) R21.2 U2.21(SPC)
TIM1 CH1: U2.41(INHC) ; port Gate Drive Signals.INHC
TIM1 CH1N: U2.42(INLC) ; port Gate Drive Signals.INLC
TIM1 CH2: U2.37(INHA) ; port Gate Drive Signals.INHA
TIM1 CH2N: U2.38(INLA) ; port Gate Drive Signals.INLA
TIM1 CH3: U2.39(INHB) ; port Gate Drive Signals.INHB
TIM1 CH3N: U2.40(INLB) ; port Gate Drive Signals.INLB
NetC13_2: C13.2 U2.5(VCP)
NetC14_1: C14.1 U2.4(CPH)
NetC14_2: C14.2 U2.3(CPL)
NetC16_1: C16.1 U2.44(CB)
NetC16_2: C16.2 D1.1(C) L1.1 U2.45(SW)
NetR10_1: R10.1 U2.48(~{SHDN})

Not connected (* = marked no-connect by the designer): U2 46(NC)*

### Notes on the sheet
- 6S = 22.2V
- +3.3V
- DRV8323 Motor Driver
- Drive FETs
- Integrated Buck Converter
- Shunt Current Sense
- Try and add a series short resistor to the SPA, SPB, and SPC pins to enable/disable VDS sensing.
- Labels drawn without touching a wire or pin: +3V3, +VBATT, GND

### Library data of the parts
C11 = CMP-06035-034802-1: Multi-Layer Ceramic Capacitor 1uF 6.3V X7R ±10% 0402 Paper T/R
C12 C16 C19 C23 C29 = CMP-45632-000007-1: CAP CER 0.1UF 50V X7R 0603; Tolerance: 10%; Capacitance: 100nF; Radiation Hardening: No; Depth: 0.8mm; Length: 1.6mm; Voltage Rating: 50V; Dielectric: X7R; Case/Package: 0603; RoHS Compliant: Yes; Case Code (Metric): 1608; Voltage Rating (DC): 50V; Min Operating Temperature: -55°C; Series: -; Max Operating Temperature: 125°C; Lead Free: Lead Free; Case Code (Imperial): 0603; Packaging: Tape and Reel
C13 = CMP-2007-03229-1: Part Number: C0805C105J4RACTU; Manufacturer: Kemet
C14 = CMP-2006-03882-2: CAP CER 0.047UF 25V 10% X7R 0603; Manufacturer: KEMET; Manufacturer Part Number: C0603C473K3RACTU; Capacitance: 47,000 pF; Temperature Coefficient: 30ppm/°C; Material: Ceramic; Tolerance: 0.1; Value: 47,000 pF; Automotive Grade: Grade 1; Height: 0.87mm; Voltage Rating: 25 V; Automotive: Yes; Device Class L3: Ceramic Capacitors; Device Class L2: Capacitors; Mouser Description: Multilayer Ceramic Capacitor, C Series, 0.047 - F, - 10%, X7R, 25 V, 0603 [1608 Metric] Rohs Compliant: Yes; Digikey Description: CAP CER 0.047UF 25V 10% X7R 0603; Temperature Characteristic: X7R; Package: C0603C-CF; Device Class L1: Passive Components; Temperature: -55°C to +125°C; Octopart: https://octopart.com/c0603c473k3ractu-kemet-3834514; RoHS: TRUE; ComponentLink2Description: Datasheet; Temperature Range Low: -55°C; Temperature Range High: +125°C; Category: Cap; ComponentLink2URL: https://api.kemet.com/component-edge/download/datasheet/C0603C100J5GACAUTO.pdf; Lead Free: Yes
C15 = CMP-06035-004402-1: Chip Multilayer Ceramic Capacitors for General Purpose, 0805, 10uF, X5R, 15%, 10%, 50V; Voltage Rating (DC): 50V; Dielectric: X5R; Tolerance: 10%; Capacitance: 10uF; Thickness: 1.25mm; Length: 2mm; Width: 1.25mm
C18 = CMP-06035-051066-1: Chip Multilayer Ceramic Capacitors for General Purpose, 0805, 22uF, X7R, 15%, 20%, 10V
C20 C24 C32 = CMP-06035-012295-1: Chip Multilayer Ceramic Capacitors for General Purpose, 0805, 4.7uF, X7R, 15%, 20%, 50V
D1 = CMP-2000-05885-2: DIODE SCHOTTKY 60V 1A SMA; Polarity: Standard; Element Configuration: Single; Peak Reverse Current: 500uA; Capacitance: 110pF; Peak Non-Repetitive Surge Current: 30A; Forward Voltage: 700mV; Termination: SMD/SMT; Radiation Hardening: No; Number of Pins: 2; Packaging: Tape and Reel; Length: 4.6mm; Current Rating: 1A; Lead Free: Lead Free; Output Current: 1A; Max Operating Temperature: 150°C; Min Operating Temperature: -65°C; Forward Current: 1A; Mount: Surface Mount; Width: 2.92mm; Average Rectified Current: 1A; Max Forward Surge Current (Ifsm): 30A; Voltage Rating (DC): 60V; Height: 2.1mm; REACH SVHC: No SVHC; Max Reverse Voltage (DC): 60V; Max Repetitive Reverse Voltage (Vrrm): 60V; Weight: 0.002258oz; Contact Plating: Tin; Case/Package: SMA; Package Quantity: 5000
L1 = CMP-06042-012393-1: Wire Wound Ferrite Inductor for Power Lines 22μH ±20% 0.132Ω 1500mA 2020 / LQH5BPN220M38L
Q1-Q6 = STL130N6F7: MOSFET (N-Channel); Manufacturer_Name: STMicroelectronics; Datasheet Link: https://www.st.com/resource/en/datasheet/stl130n6f7.pdf; Height: 1mm; Manufacturer_Part_Number: STL130N6F7; Mouser Part Number: 511-STL130N6F7; Mouser Price/Stock: https://www.mouser.co.uk/ProductDetail/STMicroelectronics/STL130N6F7?qs=bKenfurwlsn66DUeXqgWIw%3D%3D; Arrow Part Number: STL130N6F7; Arrow Price/Stock: https://www.arrow.com/en/products/stl130n6f7/stmicroelectronics?utm_currency=USD&region=nac
R9 R11 = CMP-2000-04303-1: Manufacturer: Yageo; Part Number: RC0603JR-1010KL
R10 = CMP-2000-04193-1: Manufacturer: Yageo; Part Number: RC0603FR-13100KL
R12 = CMP-1659-00059-1: Chip Resistor, 33.2 KOhm, +/- 1%, 100 mW, -55 to 155 degC, 0603 (1608 Metric), RoHS, Tape and Reel; Tolerance: 20ppm; Capacitance: 1.8E-11 f; Resistance: 70 Ohm; Frequency: 12 MHz; Load Capacitance: 18 pF; Length: 0.197 inch; Min Operating Temperature: -20degC; PackageReference: 0603; ComponentLink2URL: http://www.yageo.com/documents/recent/PYu-RC_Group_51_RoHS_L_04.pdf; Radiation Hardening: No; Package Quantity: 1000; Height: 0.043 inch; Packaging: Tape and Reel; ComponentLink1URL: http://www.yageo.com/; PackageDescription: 2-Pin Surface Mount Device, Body 1.6 x 0.8 mm; Max Operating Temperature: 70degC; ComponentLink1Description: Manufacturer URL; DatasheetVersion: Rev. 4, 02/2016; Width: 0.126 inch; ComponentLink2Description: Datasheet; Frequency Tolerance: 20ppm; Case/Package: CSMD; Pins: 4; RoHSCompliant: True; ESR: 70 Ohm; REACH SVHC: No SVHC; Mount: Surface Mount
R13 = CMP-03412-009989-1: RES SMD 10K OHM 0.1% 1/10W 0603; Manufacturer: Yageo; Manufacturer Part Number: RT0603BRC0710KL; Tolerance: 0.001; Value: 10KΩ; Power Rating: 0.1W; Voltage Rating: 75V; Temperature Coefficient: 15 ppm/°C; Device Class L2: Resistors; Temperature: -55°C to +155°C; Device Class L3: Chip SMD Resistors; Series: RT; RoHS: TRUE; Category: Res; Composition: Thin Film; Temperature Range Low: -55°C; Resistance: 10KΩ; Temperature Range High: +155°C; Package: RT0603; Height: 0.55mm; Automotive: No; Device Class L1: Passive Components; Lead Free: Yes; Digikey Description: RES SMD 10K OHM 0.1% 1/10W 0603; Ipc Land Pattern Name: RESC16080X45; Octopart: https://octopart.com/rt0603brc0710kl-yageo-20648660; Footprint Url: http://www.yageo.com/exep/pages/download/literatures/PYu-R_Mount_10.pdf; ComponentLink2Description: Datasheet; ComponentLink2URL: http://www.yageo.com/documents/recent/PYu-RT_1-to-0.01_RoHS_L_9.pdf; Mouser Description: Res Thin Film 0603 10K Ohm 0.1% 1/10W ±15ppm/°C Molded SMD Paper T/R
R19-R21 = CMP-00030-39744854-1: WSL20101L000FEA18 Res Metal Strip 2010 0.001 Ohm 1% 1W ±275ppm/C Sulfur Resistant Pad SMD Automotive T/R; Resistance: 1mΩ; Temperature Coefficient: 275ppm/°C; Power Rating: 500mW; Max Power Dissipation: 1W; Features: Moisture Resistant; Number of Pins: 2010; Mount: Surface Mount; Radiation Hardening: No; Packaging: Cut Tape; REACH SVHC: Unknown; Tolerance: 1%; Depth: 2.54mm; Termination: SMD/SMT; NexarPartId: 39744854; Schedule B: 8533210045, 8533210045; Min Operating Temperature: -65°C; Contact Plating: Tin; Length: 5.08mm; Lead Free: Lead Free; Max Operating Temperature: 170°C; RoHS: Compliant; Case Code (Imperial): 2010; Width: 2.54mm; Case Code (Metric): 5025; Composition: Metal Element, Metal Strip; Height: 635µm; Number of Terminations: 2; Case/Package: 2010
U2 = CMP-04915-000002-1: IC MTR DRV MULTIPHAS 6-60V 48QFN; Manufacturer: Texas Instruments; Min Supply Voltage: 4V; Switching Frequency: 700kHz; Nominal Supply Current: 10.5mA; Max Supply Voltage: 60V; Standoff Height: 0mm; Motor Type: Brushless DC; Output Current: 5mA; Max Junction Temp: +150°C; Category: IC; Digikey Description: IC MTR DRV MULTIPHAS 6-60V 48QFN; Height: 1mm; Lead Free: Yes; Device Class L1: Integrated Circuits (ICs); ComponentLink2Description: Datasheet; Manufacturer Part Number: DRV8323RSRGZR; RoHS: TRUE; ComponentLink2URL: http://www.ti.com/lit/ds/symlink/drv8323r.pdf; Ambient Temperature Range Low: -40°C; Octopart: https://octopart.com/drv8323rsrgzr-texas+instruments-80665177; Ambient Temperature Range High: +125°C; Temperature Range Low: -40°C; Temperature Range High: +125°C; Device Class L3: Motor Drivers; Package: RGZ0048A; Automotive: No; Device Class L2: Power Management ICs; Temperature: -40°C to +125°C; Mouser Description: Triple Half Bridge Motor Driver 48-Pin VQFN EP T/R

## Sheet SensingSchDoc.SchDoc
size A4; SheetNumber: 4; SheetTotal: 6
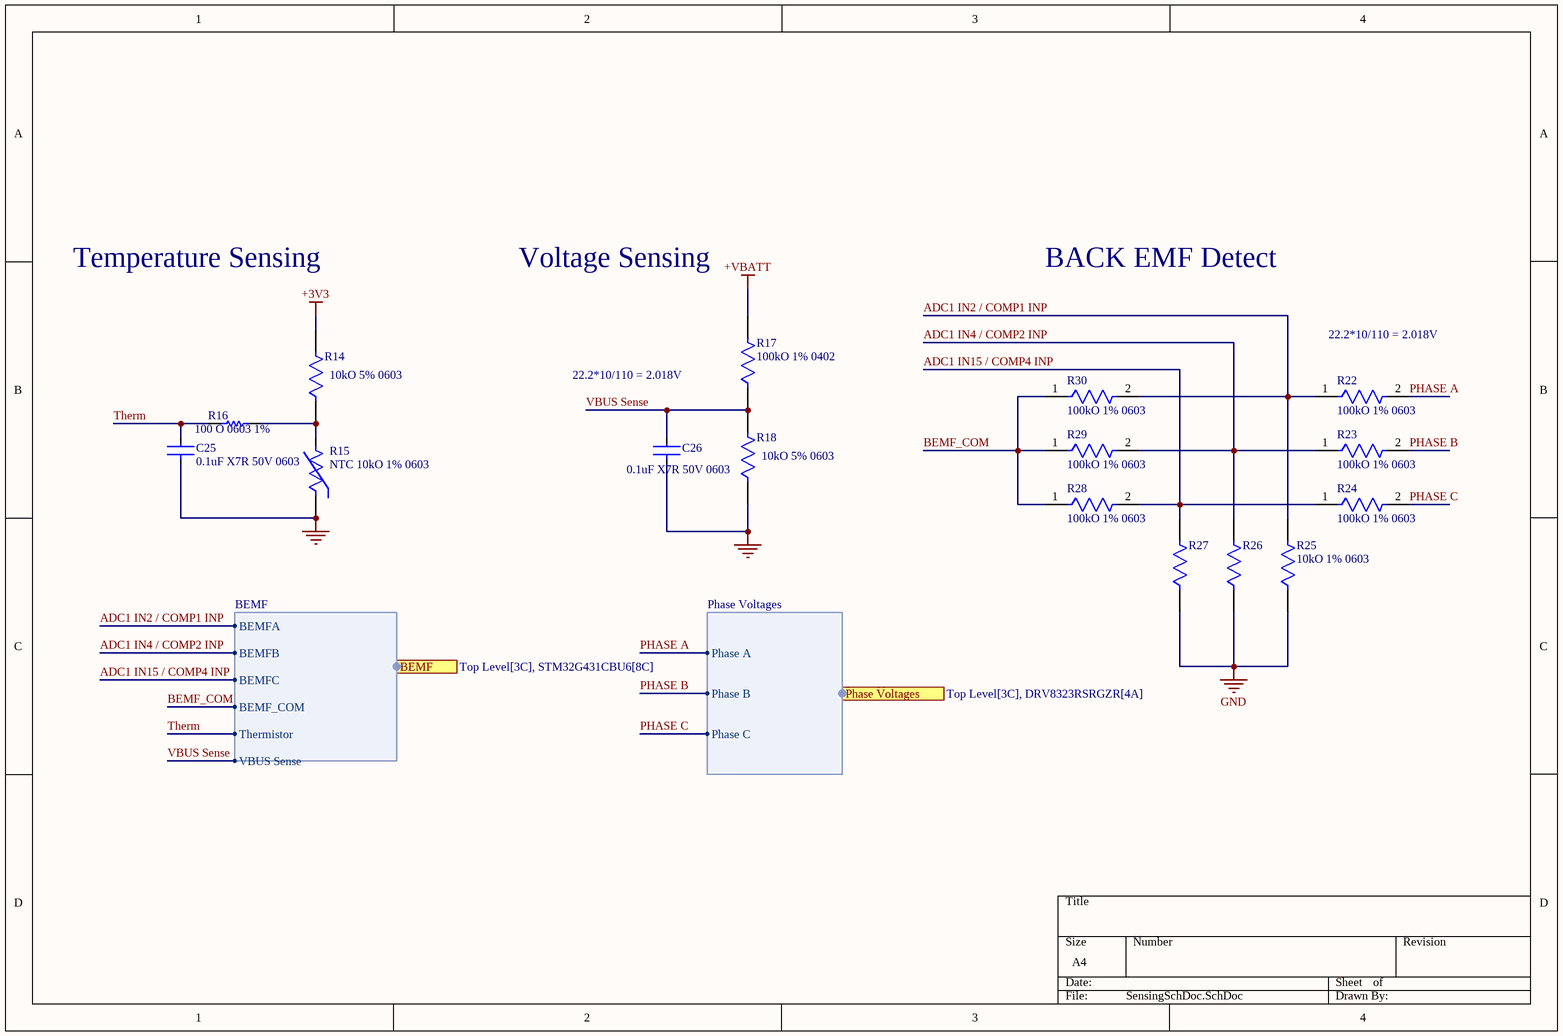
[diagram p3: SensingSchDoc.SchDoc]

### Parts
C25  0.1uF X7R 50V 0603  [FP-0603B104K500CT-IPC_C]
C26  0.1uF X7R 50V 0603  [FP-0603B104K500CT-IPC_C]
R14  10kO 5% 0603  [FP-AC0603-IPC_A]
R15  NTC 10kO 1% 0603  [FP-NCP18-0_15-IPC_A]
R16  100 O 0603 1%  [RESC1608X55X25ML10T15]
R17  100kO 1% 0402  [FP-CRGP0402-IPC_C]
R18  10kO 5% 0603  [FP-AC0603-IPC_A]
R22  100kO 1% 0603  [FP-RT0603-MFG]
R23  100kO 1% 0603  [FP-RT0603-MFG]
R24  100kO 1% 0603  [FP-RT0603-MFG]
R25  10kO 1% 0603  [FP-MCT0603-IPC_C]
R26  10kO 1% 0603  [FP-MCT0603-IPC_C]  (value not drawn)
R27  10kO 1% 0603  [FP-MCT0603-IPC_C]  (value not drawn)
R28  100kO 1% 0603  [FP-RT0603-MFG]
R29  100kO 1% 0603  [FP-RT0603-MFG]
R30  100kO 1% 0603  [FP-RT0603-MFG]

### Ports
BEMF (harness BEMF, see Top Level[3C], STM32G431CBU6[8C]), Phase Voltages (harness Phase Voltages, see Top Level[3C], DRV8323RSRGZR[4A])

### Harnesses
Phase Voltages: Phase A, Phase B, Phase C
BEMF: BEMFA, BEMFB, BEMFC, VBUS Sense, Thermistor, BEMF_COM

### Nets
+3V3: R14.2
+VBATT: R17.2
GND: C25.1 C26.1 R15.1 R18.1 R25.1 R26.1 R27.1  [project net SNA]
ADC1 IN2 / COMP1 INP: R22.1 R25.2 R30.2 ; port BEMF.BEMFA
ADC1 IN4 / COMP2 INP: R23.1 R26.2 R29.2 ; port BEMF.BEMFB
ADC1 IN15 / COMP4 INP: R24.1 R27.2 R28.2 ; port BEMF.BEMFC
BEMF_COM: R28.1 R29.1 R30.1 ; port BEMF.BEMF_COM  [project net ADC1 IN3/COMP2 INM]
PHASE A: R22.2 ; port Phase Voltages.Phase A
PHASE B: R23.2 ; port Phase Voltages.Phase B
PHASE C: R24.2 ; port Phase Voltages.Phase C
Therm: C25.2 R16.1 ; port BEMF.Thermistor
VBUS Sense: C26.2 R17.1 R18.2 ; port BEMF.VBUS Sense
NetR14_1: R14.1 R15.2 R16.2

### Notes on the sheet
- Temperature Sensing
- Voltage Sensing
- BACK EMF Detect
- 22.2*10/110 = 2.018V

### Library data of the parts
C25 C26 = CMP-45632-000007-1: as C12 on sheet DRV8323RSRGZR; Radiation Hardening: No; Depth: 0.8mm; Length: 1.6mm; Voltage Rating: 50V; Dielectric: X7R; Case/Package: 0603; RoHS Compliant: Yes; Case Code (Metric): 1608; Voltage Rating (DC): 50V; Min Operating Temperature: -55°C; Series: -; Max Operating Temperature: 125°C; Lead Free: Lead Free; Case Code (Imperial): 0603; Packaging: Tape and Reel
R14 R18 = CMP-03412-040683-1: RES 10kΩ 5.00% 0.2W 0603
R15 = CMP-2000-05271-3: NTC Thermistor for Temperature Sensor, 0603, 10kΩ, 1%, 0.1mA, 5V; Manufacturer Series: NCP18; Accuracy: 0.7%; Current Rating: 310uA; Max Power Dissipation: 100mW; Thermistor Application: TEMPERATURE COMPENSATION; Number of Terminals/Pins: 2; Resistance: 10kR; Case Code (Metric): 1608; RoHS Compliant: Yes; Max Operating Temperature: 125°C; Resistance Tolerance: 1%; Case/Package: 0603; Mount: Surface Mount; Lead Free: Lead Free; Min Operating Temperature: -40°C; REACH SVHC: No SVHC; Package Shape: Rectangular; Radiation Hardening: No; Series: NCP; Depth: 0.8mm; Number of Pins: 2; Length: 1.6mm; Height: 0.8mm; Terminal Placement: Dual; Tolerance: 1%; Case Code (Imperial): 0603; Terminal Finish: Tin; Power Rating: 100mW; Termination: SMD/SMT; Packaging: Tape and Reel; Package Quantity: 1
R16 = CMP-2000-04173-1: as R6 on sheet STM32G431CBU6
R17 = CMP-03211-001392-1: SMD Precision Pulse Thick Film Chip Resistor; Manufacturer Part Number: CRGP0402F100K; Manufacturer: TE; Value: 100KΩ; Power Rating: 0.125W; Tolerance: 0.01; Temperature Coefficient: ±100ppm/°C; Voltage Rating: 50V; Octopart: https://octopart.com/crgp0402f100k-te+connectivity-91018658; Ipc Land Pattern Name: RESC11050X35; Digikey Description: SMD Precision Pulse Thick Film Chip Resistor; Composition: Thick Film; Device Class L3: Chip SMD Resistors; Package: CRGP0402; Temperature: -55°C to +155°C; Category: Res; Device Class L1: Passive Components; Temperature Range High: +155°C; ComponentLink2URL: https://www.mouser.ca/datasheet/2/418/NG_DS_9-1773463-9_A-1358566.pdf; Temperature Range Low: -55°C; Series: CRGP; Resistance: 100KΩ; Automotive: No; Lead Free: Yes; RoHS: TRUE; Device Class L2: Resistors; Height: 0.4mm; ComponentLink2Description: Datasheet
R22-R24 R28-R30 = CMP-03412-013434-1: RT0603 100KΩ 0.1W 50 ppm/°C 1.00%; Manufacturer Part Number: RT0603FRE13100KL; Manufacturer: Yageo; Tolerance: 0.01; Voltage Rating: 75V; Temperature: -55°C to +155°C; Automotive: No; Power Rating: 0.1W; Mouser Description: Thin Film Resistors - SMD 1/10W 100K ohm 1% 50ppm; Device Class L1: Passive Components; Device Class L3: Chip SMD Resistors; Series: RT; ComponentLink2URL: http://www.yageo.com/documents/recent/PYu-RT_1-to-0.01_RoHS_L_9.pdf; Package: RT0603; Category: Res; Device Class L2: Resistors; Value: 100KΩ; RoHS: TRUE; Composition: Thin Film; Temperature Range Low: -55°C; Lead Free: Yes; Resistance: 100KΩ; Temperature Range High: +155°C; Ipc Land Pattern Name: RESC16080X45; Octopart: https://octopart.com/rt0603fre13100kl-yageo-16261755; Footprint Url: http://www.yageo.com/exep/pages/download/literatures/PYu-R_Mount_10.pdf; ComponentLink2Description: Datasheet; Temperature Coefficient: 50 ppm/°C; Height: 0.55mm
R25-R27 = CMP-02407-001600-1: RES SMD 100 OHM 1% 1/8W 0603; Max Power Dissipation: 100mW; Resistance: 10kR; Temperature Coefficient: 50ppm/°C; Length: 0.061inch; Depth: 0.85mm; Military Standard: Not; Max Operating Temperature: 125°C; Height: 0.022inch; Case/Package: 0603; Packaging: Tape and Reel; Number of Terminations: 2; Composition: Thin Film; Min Operating Temperature: -55°C; Width: 0.033inch; Tolerance: 1%; Lead Free: Lead Free

## Sheet CAN.SchDoc
size A4; SheetNumber: 5; SheetTotal: 6
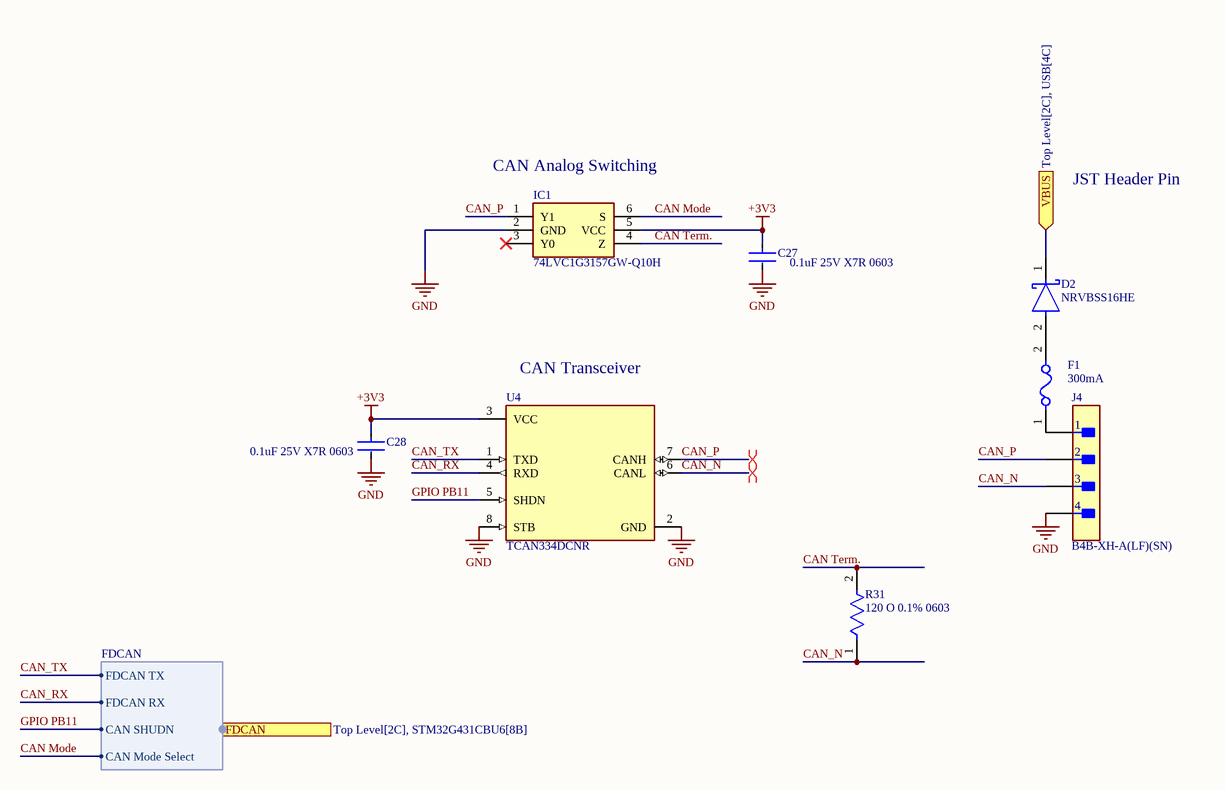
[diagram p4: CAN.SchDoc]

### Parts
C27  0.1uF 25V X7R 0603  [FP-C0603C-CF-MFG]
C28  0.1uF 25V X7R 0603  [FP-C0603C-CF-MFG]
D2  NRVBSS16HE  [FP-477AD-MFG]
F1  300mA  [FP-0805L010-MFG]
IC1  74LVC1G3157GW-Q10H  [SOT65P210X110-6N]
J4  B4B-XH-A(LF)(SN)  [FP-B4B-XH-A_LF_SN-MFG]
R31  120 O 0.1% 0603  [FP-RT0603-MFG]
U4  TCAN334DCNR  [FP-DCN0008A-IPC_C]

### Ports
FDCAN (harness FDCAN, see Top Level[2C], STM32G431CBU6[8B]), VBUS (in, see Top Level[2C], USB[4C])

### Harnesses
FDCAN: FDCAN TX, FDCAN RX, CAN SHUDN, CAN Mode Select

### Nets
+3V3: C27.1 C28.1 IC1.5(VCC) U4.3(VCC)
GND: C27.2 C28.2 IC1.2(GND) J4.4 U4.2(GND) U4.8(STB)  [project net SNA]
CAN Mode: IC1.6(S) ; port FDCAN.CAN Mode Select
CAN Term.: IC1.4(Z) R31.2
CAN_N: J4.3 R31.1 U4.6(CANL)
CAN_P: IC1.1(Y1) J4.2 U4.7(CANH)
CAN_RX: U4.4(RXD) ; port FDCAN.FDCAN RX
CAN_TX: U4.1(TXD) ; port FDCAN.FDCAN TX
GPIO PB11: U4.5(SHDN) ; port FDCAN.CAN SHUDN
VBUS: D2.1(C) ; port VBUS
NetD2_2: D2.2(A) F1.2
NetF1_1: F1.1 J4.1

Not connected (* = marked no-connect by the designer): IC1 3(Y0)*

### Layout directives
differential pair: CAN_N, CAN_P

### Notes on the sheet
- (near IC1) CAN Analog Switching
- JST Header Pin
- (near U4) CAN Transceiver

### Library data of the parts
C27 C28 = CMP-2006-03731-2: as C2 on sheet STM32G431CBU6; Digikey Description: CAP CER 0.1UF 25V X7R 0603; RoHS: TRUE; ComponentLink2Description: Datasheet; Temperature Range High: +125°C; Temperature Characteristic: X7R; Automotive: Yes; Package: C0603C-CF; ComponentLink2URL: https://api.kemet.com/component-edge/download/datasheet/C0603C100J5GACAUTO.pdf; Lead Free: Yes; Device Class L2: Capacitors; Device Class L3: Ceramic Capacitors; Device Class L1: Passive Components; Octopart: https://octopart.com/c0603c104k3racauto-kemet-12595587; Height: 0.87mm; Mouser Description: Multilayer Ceramic Capacitors MLCC - SMD/SMT 0.1uF 25volts 10% X7R AUTO; Category: Cap; Voltage Rating: 25 V; Temperature Range Low: -55°C; Temperature: -55°C to +125°C
D2 = CMP-00278-93203857-1: NRVBSS16HE Rectifier Diode, Schottky, 1 Phase, 1 Element, 1A, 60V V(RRM), Silicon; Manufacturer Lifecycle Status: ACTIVE; Capacitance: 43pF; Max Forward Surge Current (Ifsm): 25A; Peak Reverse Current: 2µA; Max Junction Temperature (Tj): 150°C; Max Operating Temperature: 150°C; Reverse Voltage: 60V; Forward Current: 1A; Height: 750µm; Lifecycle Status: Production; RoHS: Compliant; Min Operating Temperature: -55°C; Max Repetitive Reverse Voltage (Vrrm): 60V; NexarPartId: 93203857
F1 = CMP-00227-00673855-1: 0805L010YR PTC Resettable Fuse 0.1A(hold) 0.3A(trip) 15VDC 100A 0.5W 1.5s 1Ohm SMD Solder Pad 0805 T/R; NexarPartId: 673855; Minimum Resistance Initial (Rmin): 1Ω; Maximum Resistance 1 Hour (R1max): 6Ω; Power Dissipation: 500mW; Working Voltage: 15V; Hold Current: 100mA; Approvals: TUV, cULus; Min Operating Temperature: -40°C; Max Current Rating: 100A; Case Code (Imperial): 0805; Termination: SMD/SMT; Height: 1mm; Resistance: 6Ω; Case Code (Metric): 2012; Lifecycle Status: Production; Operating Supply Voltage: 15V; Mount: Surface Mount; Voltage Rating: 15V; RoHS: Compliant; Width: 1.5mm; Length: 2.2mm; Voltage Rating (DC): 15V; Time to Trip: 1.5s; Ambient Temperature Range High: 85°C; Max Power Dissipation: 500mW; Trip Current: 300mA; Lead Free: Lead Free; Max Operating Temperature: 85°C; Current Rating: 100A; Terminal Material: Copper; Packaging: Cut Tape; REACH SVHC: No SVHC; Max Voltage Rating (DC): 15V; Case/Package: 0805
IC1 = 74LVC1G3157GW-Q10H: Integrated Circuit; Manufacturer_Name: Nexperia; Datasheet Link: https://assets.nexperia.com/documents/data-sheet/74LVC1G3157_Q100.pdf; Height: 1.1mm; Manufacturer_Part_Number: 74LVC1G3157GW-Q10H; Mouser Part Number: 771-74LVC1G3157GWQ10; Mouser Price/Stock: https://www.mouser.co.uk/ProductDetail/Nexperia/74LVC1G3157GW-Q10H?qs=5XOdhvmYM0OEi4hrMRn80A%3D%3D; Arrow Part Number: 74LVC1G3157GW-Q10H; Arrow Price/Stock: https://www.arrow.com/en/products/74lvc1g3157gw-q10h/nexperia?utm_currency=USD&region=nac
J4 = CMP-17439-000250-1: CONN HEADER VERT 4POS 2.5MM; Number of Contacts: 4; Contact Resistance: 20mR; Voltage Rating: 250V; Max Current Rating: 3A; Gender: Male; Wire/Cable Gauge: 22AWG; Mated Stacking Heights: 9.8mm; Insulation Resistance: 1GR; Orientation: Straight; Contact Type: Male Pin; Contact Finish - Mating: TIN; Series: XH; Max Voltage Rating (AC): 250V; Lead Pitch: 2.5mm; Contact Shape: Square; Insulation Color: Natural; Termination: Solder; Lead Free: Lead Free; Voltage Rating (AC): 250V; Number of Rows: 1; Flammability Rating: UL94 V-0; Number of Positions: 4; Max Operating Temperature: 85°C; Package Quantity: 500; Mount: Through Hole; REACH SVHC: No SVHC; Connector Type: Header; Insulation Material: Nylon; Fastening Type: Detent; Min Operating Temperature: -25°C; Housing Color: White; Packaging: Bulk; Contact Plating: Tin; Contact Material: Brass; Max Voltage Rating (DC): 250V; Housing Material: Polyamide; Color: Natural; Material: Polyamide; Pitch: 2.5mm; Depth: 5.75mm; Current Rating: 3A; Length: 12.4mm
R31 = CMP-03412-006948-1: RES SMD 120 OHM 0.1% 1/10W 0603; Manufacturer Part Number: RT0603BRC07120RL; Manufacturer: Yageo; Value: 120Ω; Tolerance: 0.001; Power Rating: 0.1W; Voltage Rating: 75V; Temperature Coefficient: 15 ppm/°C; Height: 0.55mm; Temperature: -55°C to +155°C; Ipc Land Pattern Name: RESC16080X45; ComponentLink2URL: http://www.yageo.com/documents/recent/PYu-RT_1-to-0.01_RoHS_L_9.pdf; Resistance: 120Ω; Lead Free: Yes; Digikey Description: RES SMD 120 OHM 0.1% 1/10W 0603; Series: RT; Package: RT0603; RoHS: TRUE; Footprint Url: http://www.yageo.com/exep/pages/download/literatures/PYu-R_Mount_10.pdf; Automotive: No; Device Class L3: Chip SMD Resistors; Temperature Range High: +155°C; Device Class L1: Passive Components; Octopart: https://octopart.com/rt0603brc07120rl-yageo-56543448; Composition: Thin Film; Temperature Range Low: -55°C; Category: Res; Device Class L2: Resistors; ComponentLink2Description: Datasheet
U4 = CMP-04872-000047-1: IC TRANSCEIVER 1/1 SOT23-8; Receiver Hysteresis: 120mV; Data Rate: 1Mbps; RoHS Compliant: Yes; Max Operating Temperature: 125°C; Min Operating Temperature: -40°C; Mount: Surface Mount; Packaging: Cut Tape; Lead Free: Lead Free; Case/Package: SOT-23-8

## Sheet USB.SchDoc
size A4; SheetNumber: 6; SheetTotal: 6
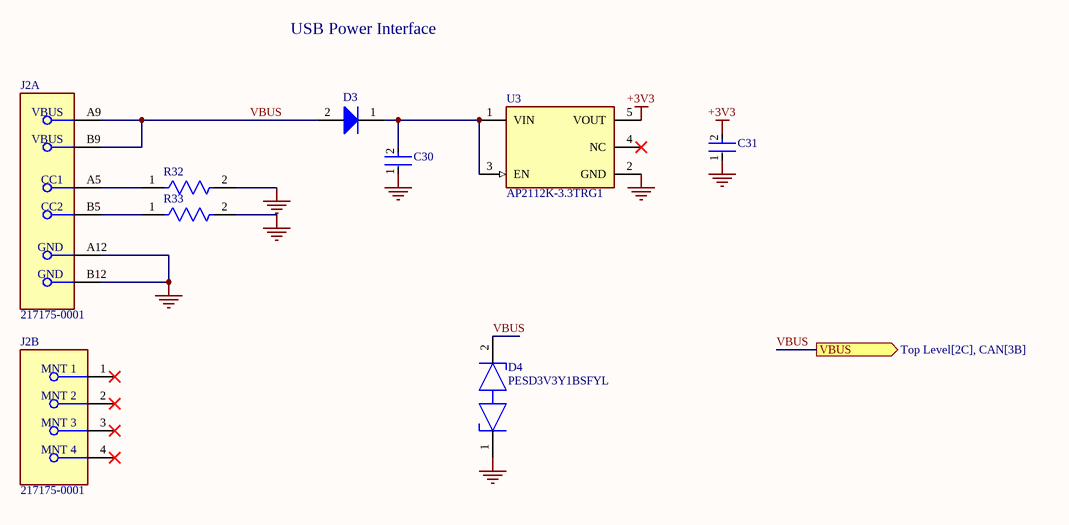
[diagram p5: USB.SchDoc]

### Parts
C30  C1608X5R1H105K080AB  [FP-C1608-080-0_1-IPC_B]  (value not drawn)
C31  C1608X5R1H105K080AB  [FP-C1608-080-0_1-IPC_B]  (value not drawn)
D3  NSR0320MW2T1G  [ONSC-SOD-323-2-477-02_V]  (value not drawn)
D4  PESD3V3Y1BSFYL  [FP-SOD962-2-CA-MFG]
J2  217175-0001  [FP-217175-0001-MFG]  (parts A,B of 2)
R32  RN73R1ETTP5101F25  [FP-RN73R1E-IPC_C]  (value not drawn)
R33  RN73R1ETTP5101F25  [FP-RN73R1E-IPC_C]  (value not drawn)
U3  AP2112K-3.3TRG1  [FP-SOT25-IPC_A]

### Ports
VBUS (out, see Top Level[2C], CAN[3B])

### Nets
+3V3: C31.2 U3.5(VOUT)
GND: C30.1 C31.1 D4.1 J2.A12(GND) J2.B12(GND) R32.2 R33.2 U3.2(GND)  [project net SNA]
VBUS: D3.2(A) D4.2 J2.A9(VBUS) J2.B9(VBUS) ; port VBUS
NetC30_2: C30.2 D3.1(K) U3.1(VIN) U3.3(EN)
NetJ2_A5: J2.A5(CC1) R32.1
NetJ2_B5: J2.B5(CC2) R33.1

Not connected (* = marked no-connect by the designer): J2 1(MNT_1)* 2(MNT_2)* 3(MNT_3)* 4(MNT_4)*; U3 4(NC)*

### Notes on the sheet
- USB Power Interface

### Library data of the parts
C30 C31 = CMP-2000-06025-2: Multilayer Ceramic Capacitors 1μF ±10% 50V X5R SMD 0603; Capacitance: 1uF; Lead Free: Lead Free; Height: 0.8mm; Mount: Surface Mount; Radiation Hardening: No; Thickness: 0.035inch; Length: 1.6mm; Max Operating Temperature: 85°C; REACH SVHC: No SVHC; Min Operating Temperature: -55°C; Construction: Flat; RoHS Compliant: Yes; Voltage Rating: 50V; Dielectric: X5R; Packaging: Tape and Reel; Termination: SMD/SMT; Voltage Rating (DC): 50V; Case Code (Imperial): 0603; Voltage: 50V; Width: 0.031inch; Weight: 7.1E-05oz; Depth: 0.8mm; Case Code (Metric): 1608; Series: C; Case/Package: 0603; Tolerance: 10%; Resistor Type: Ceramic; Number of Pins: 2; Dielectric Material: Ceramic; Package Quantity: 1
D3 = CMP-1055-00466-1: Schottky Barrier Diode, 2-Pin SOD-323, Pb-Free, Tape and Reel; Manufacturer: On Semiconductor; Configuration: Single; IFSM Max (A): 5; Mounting Technology: Surface Mount; Packing: Tape and Reel; PackageDescription: 2-Pin SOD, Body 1.7 x 1.25 mm; ComponentLink3Description: Package Specification; PartNumber: NSR0320MW2T1G; ComponentLink1URL: http://www.onsemi.com/; PackageReference: SOD-323-2-477-02; RoHS: TRUE; PackageVersion: Rev. H, 03/2007; DatasheetVersion: Rev. 4; ComponentLink1Description: Manufacturer URL; ComponentLink3URL: http://www.onsemi.com/pub_link/Collateral/477-02.PDF.1; ComponentLink2Description: Datasheet; ComponentLink2URL: http://www.onsemi.cn/pub_link/Collateral/NSR0320MW2T1-D.PDF
D4 = CMP-11424-92175759-2: PESD3V3Y1BSFYL PESD4V0Y1BSF - Extremely low capacitance bidirectional ESD protection diode; Manufacturer Lifecycle Status: RELEASED FOR SUPPLY; Number of Channels: 1; Breakdown Voltage: 4.2V; Clamping Voltage: 3.7V; Capacitance: 240fF; Reverse Standoff Voltage: 3.3V; Height: 320µm; RoHS: Non-Compliant; Ambient Temperature Range High: 125°C; NexarPartId: 92175759; Direction: Bidirectional; Lifecycle Status: Production; Schedule B: 8536300000
J2 = CMP-04767-000026-1: CONN RCP USB2.0 C 6+18P SMD RA
R32 R33 = CMP-04015-008529-1: 5.1kΩ ±1% 0.063W, 1/16W Chip Resistor 0402 (1005 Metric) Moisture Resistant Thin Film
U3 = CMP-12756-000035-1: IC REG LINEAR 3.3V 600MA SOT25; Number of Regulators: 1; Output Type: Fixed; Polarity: Positive; Min Input Voltage: 2.5V; Max Input Voltage: 6V; Accuracy: 1.5%; Quiescent Current: 55uA; Dropout Voltage: 250mV; Min Operating Temperature: -40°C; Length: 3.1mm; Output Current: 600mA; Max Operating Temperature: 85°C; Package Quantity: 1; Output Voltage: 3.3V; Width: 1.7mm; Number of Outputs: 1; Packaging: Tape and Reel; Height: 1.3mm; Lead Free: Lead Free; Max Output Current: 600mA; Case/Package: SOT-23-5; Mount: Surface Mount; Number of Pins: 5

## Nets that join several sheets
+3V3: STM32G431CBU6 (12 pins), DRV8323RSRGZR (8 pins), SensingSchDoc (R14.2), CAN (C27.1 C28.1 IC1.5 U4.3), USB (C31.2 U3.5)
+VBATT: STM32G431CBU6 (7 pins), DRV8323RSRGZR (28 pins), SensingSchDoc (R17.2)
SNA: STM32G431CBU6 (26 pins), DRV8323RSRGZR (23 pins), SensingSchDoc (7 pins), CAN (6 pins), USB (8 pins)
ADC1 IN2 / COMP1 INP: STM32G431CBU6 (U1.9), SensingSchDoc (R22.1 R25.2 R30.2)
ADC1 IN3/COMP2 INM: STM32G431CBU6 (U1.10 U1.12 U1.19), SensingSchDoc (R28.1 R29.1 R30.1)
ADC1 IN4 / COMP2 INP: STM32G431CBU6 (U1.11), SensingSchDoc (R23.1 R26.2 R29.2)
ADC1 IN15 / COMP4 INP: STM32G431CBU6 (U1.17), SensingSchDoc (R24.1 R27.2 R28.2)
CAN Mode: STM32G431CBU6 (R4.2), CAN (IC1.6)
CAN_RX: STM32G431CBU6 (U1.33), CAN (U4.4)
CAN_TX: STM32G431CBU6 (U1.47), CAN (U4.1)
GPIO PB11: STM32G431CBU6 (U1.24), CAN (U4.5)
GPIO PB12: STM32G431CBU6 (U1.25), DRV8323RSRGZR (U2.32)
GPIO PB13: STM32G431CBU6 (U1.26), DRV8323RSRGZR (U2.33)
GPIO PC10: STM32G431CBU6 (U1.39), DRV8323RSRGZR (U2.34)
PHASE A: DRV8323RSRGZR (9 pins), SensingSchDoc (R22.2)
PHASE B: DRV8323RSRGZR (9 pins), SensingSchDoc (R23.2)
PHASE C: DRV8323RSRGZR (9 pins), SensingSchDoc (R24.2)
SCLK: STM32G431CBU6 (U1.41), DRV8323RSRGZR (U2.31)
SDI: STM32G431CBU6 (U1.43), DRV8323RSRGZR (U2.30)
SDO: STM32G431CBU6 (U1.40), DRV8323RSRGZR (R9.1 U2.29)
SOA: STM32G431CBU6 (R6.2), DRV8323RSRGZR (U2.25)
SOB: STM32G431CBU6 (R7.2), DRV8323RSRGZR (U2.24)
SOC: STM32G431CBU6 (R8.2), DRV8323RSRGZR (U2.23)
TIM1 CH1: STM32G431CBU6 (U1.32), DRV8323RSRGZR (U2.41)
TIM1 CH1N: STM32G431CBU6 (U1.2), DRV8323RSRGZR (U2.42)
TIM1 CH2: STM32G431CBU6 (U1.31), DRV8323RSRGZR (U2.37)
TIM1 CH2N: STM32G431CBU6 (U1.34), DRV8323RSRGZR (U2.38)
TIM1 CH3: STM32G431CBU6 (U1.30), DRV8323RSRGZR (U2.39)
TIM1 CH3N: STM32G431CBU6 (U1.28), DRV8323RSRGZR (U2.40)
VBUS: CAN (D2.1), USB (D3.2 D4.2 J2.A9 J2.B9)
VBUS Sense: STM32G431CBU6 (U1.8), SensingSchDoc (C26.2 R17.1 R18.2)